# EAGLE design ledgroup (EAGLE 5.11)
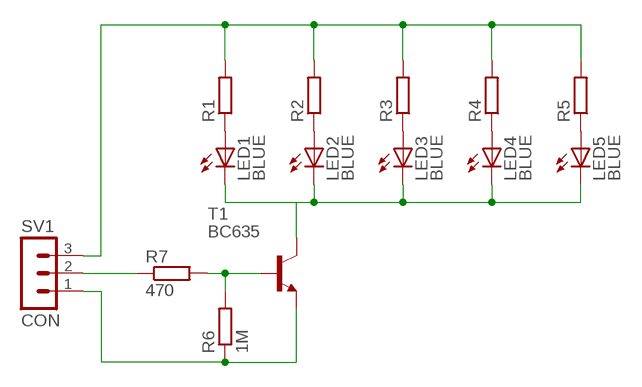
[diagram p0: schematic, sheet 1]

## Parts
LED1  BLUE  LED3MM  [LED3MM]
LED2  BLUE  LED3MM  [LED3MM]
LED3  BLUE  LED3MM  [LED3MM]
LED4  BLUE  LED3MM  [LED3MM]
LED5  BLUE  LED3MM  [LED3MM]
R1  R-EU_0204/7  [0204/7]
R2  R-EU_0204/7  [0204/7]
R3  R-EU_0204/7  [0204/7]
R4  R-EU_0204/7  [0204/7]
R5  R-EU_0204/7  [0204/7]
R6  1M  R-EU_0204/7  [0204/7]
R7  470  R-EU_0204/7  [0204/7]
SV1  CON  MA03-1  [MA03-1]
T1  BC635  BC635-NPN-TO92-ECB  [TO92-ECB]

## Nets
GND: R6.1 SV1.1 T1.E
N$2: R7.1 SV1.2
N$3: R6.2 R7.2 T1.B
N$4: LED3.A R3.1
N$5: LED2.A R2.1
N$6: LED1.A R1.1
N$7: LED4.A R4.1
N$8: LED5.A R5.1
N$9: LED1.K(C) LED2.K(C) LED3.K(C) LED4.K(C) LED5.K(C) T1.C
VCC: R1.2 R2.2 R3.2 R4.2 R5.2 SV1.3

## Library data of the parts
LED1-LED5 = led:LED: LED OSRAM: - CHIPLED LG R971, LG N971, LY N971, LG Q971, LY Q971, LO R971, LY R971 LH N974, LH R974 LS Q976, LO Q976, LY Q976 LO Q996 - Hyper CHIPLED LW Q18S LB Q993, LB Q99A, LB R99A - SideLED LS A670, LO A670, LY A670, LG A670, LP A670 LB A673, LV A673, LT A673, LW A673 LH A674 LY A675 LS A676, LA A676, LO A676, LY A676, LW A676 LS A679, LY A679, LG A679 - Hyper Micro SIDELED® LS Y876, LA Y876, LO Y876, LY Y876 LT Y87S - SmartLED LW L88C, LW L88S LB L89C, LB L89S, LG L890 LS L89K, LO L89K, LY L89K LS L896, LA L896, LO L896, LY L896 - TOPLED LS T670, LO T670, LY T670, LG T670, LP T670 LSG T670, LSP T670, LSY T670, LOP T670, LYG T670 LG T671, LOG T671, LSG T671 LB T673, LV T673, LT T673, LW T673 LH T674 LS T676, LA T676, LO T676, LY T676, LB T676, LH T676, LSB T676, LW T676 LB T67C, LV T67C, LT T67C, LS T67K, LO T67K, LY T67K, LW E67C LS E67B, LA E67B, LO E67B, LY E67B, LB E67C, LV E67C, LT E67C LW T67C LS T679, LY T679, LG T679 LS T770, LO T770, LY T770, LG T770, LP T770 LB T773, LV T773, LT T773, LW T773 LH T774 LS E675, LA E675, LY E675, LS T675 LS T776, LA T776, LO T776, LY T776, LB T776 LHGB T686 LT T68C, LB T68C - Hyper Mini TOPLED® LB M676 - Mini TOPLED Santana® LG M470 LS M47K, LO M47K, LY M47K Source: http://www.osram.convergy.de LUXEON: - LUMILED® LXK2-PW12-R00, LXK2-PW12-S00, LXK2-PW14-U00, LXK2-PW14-V00 LXK2-PM12-R00, LXK2-PM12-S00, LXK2-PM14-U00 LXK2-PE12-Q00, LXK2-PE12-R00, LXK2-PE12-S00, LXK2-PE14-T00, LXK2-PE14-U00 LXK2-PB12-K00, LXK2-PB12-L00, LXK2-PB12-M00, LXK2-PB14-N00, LXK2-PB14-P00, LXK2-PB14-Q00 LXK2-PR12-L00, LXK2-PR12-M00, LXK2-PR14-Q00, LXK2-PR14-R00 LXK2-PD12-Q00, LXK2-PD12-R00, LXK2-PD12-S00 LXK2-PH12-R00, LXK2-PH12-S00 LXK2-PL12-P00, LXK2-PL12-Q00, LXK2-PL12-R00 Source: www.luxeon.com KINGBRIGHT: KA-3528ASYC Source: www.kingbright.com
R1-R7 = rcl:R-EU_: RESISTOR, European symbol
SV1 = con-lstb:MA03-1: PIN HEADER; OC_FARNELL: unknown; OC_NEWARK: unknown
T1 = transistor:*-NPN-: NPN Transistror BF959 corrected 2008.03.06

## Board
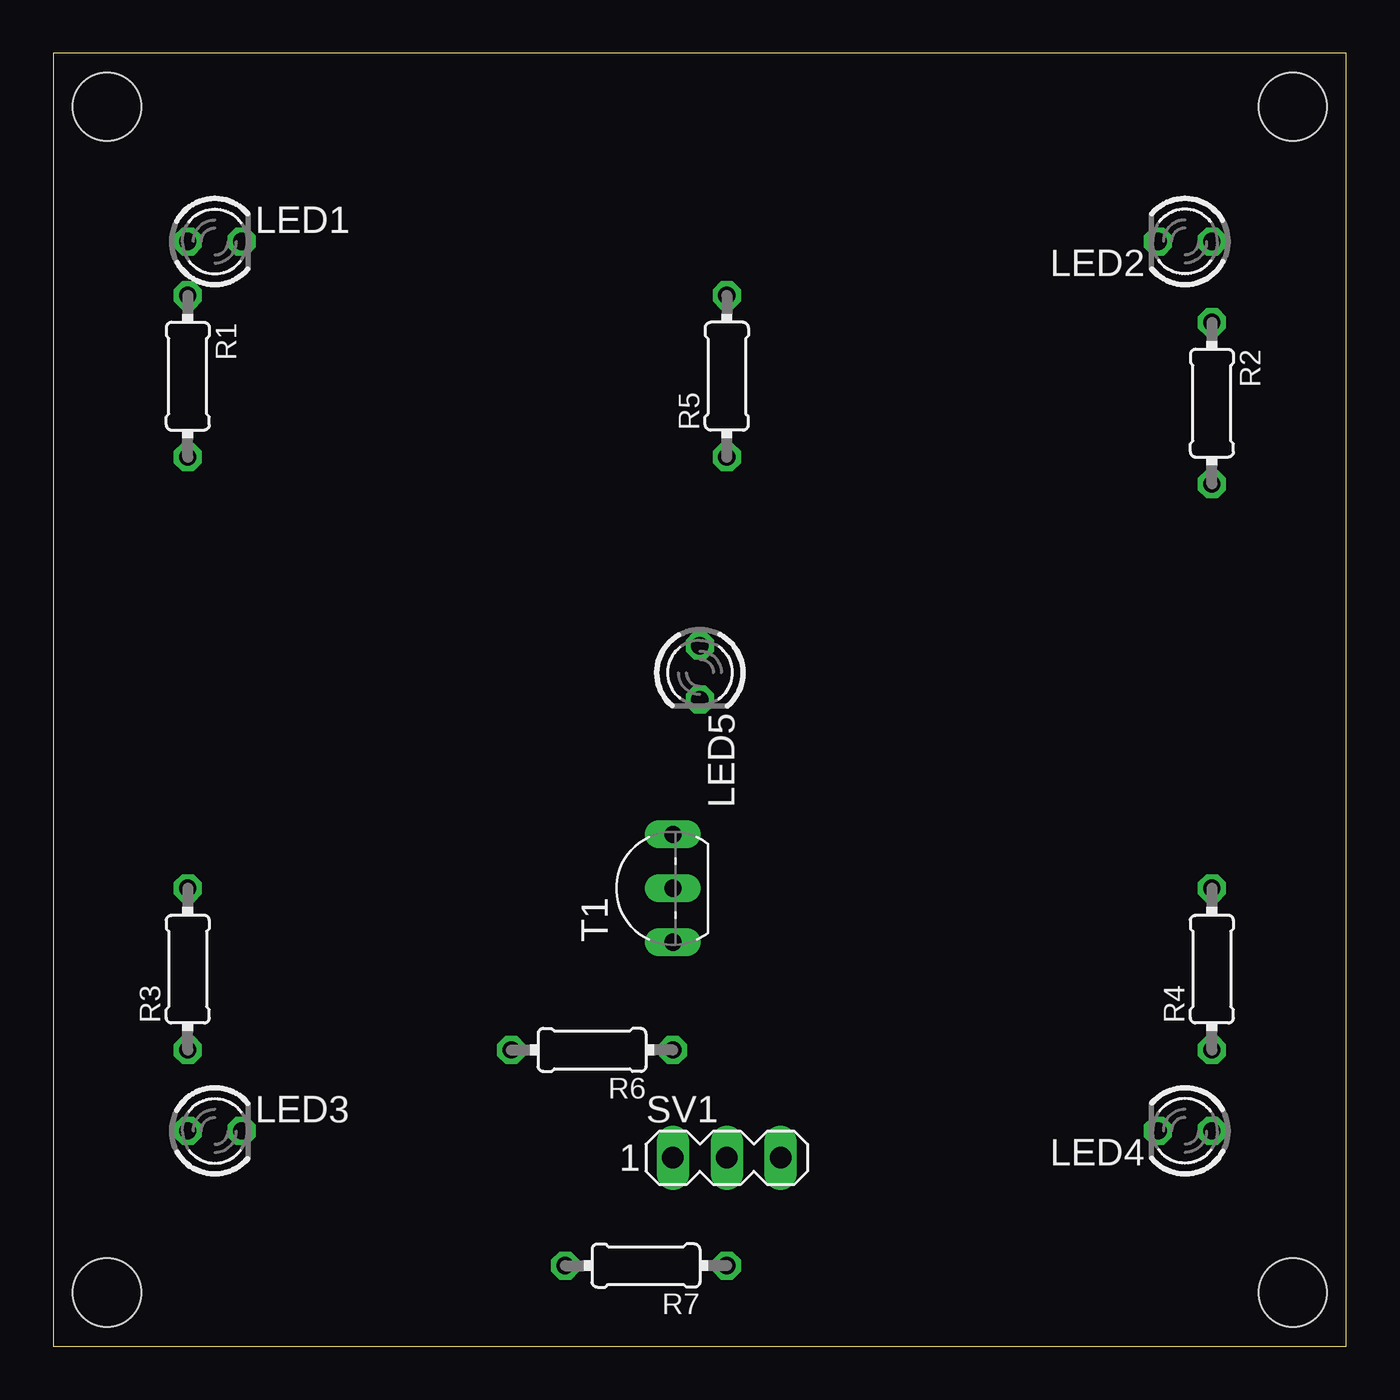
[diagram p1: board, top side]
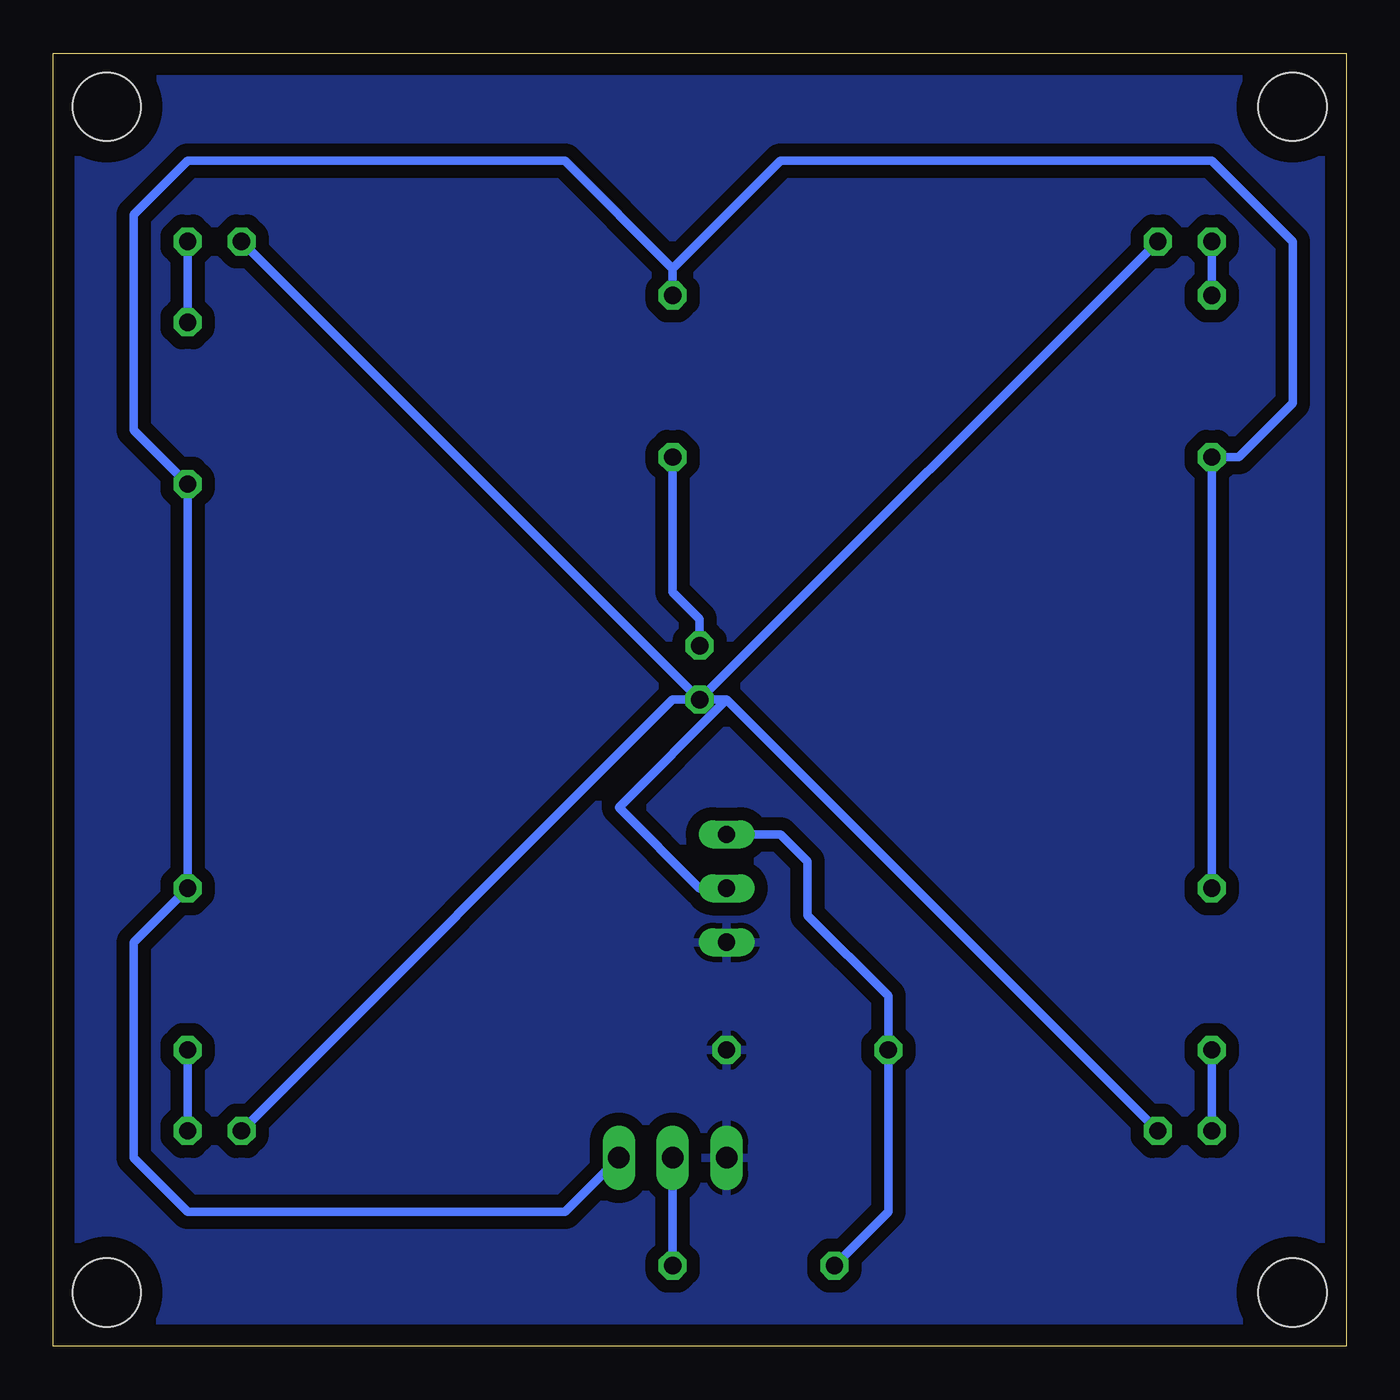
[diagram p2: board, bottom side, seen from below]

Size 60.95 x 60.95 mm. Coordinates in mm from the lower left corner, seen from the top.
Outline: 0,0 60.95,0 60.95,60.95 0,60.95 0,0
Copper layers (1*16): Top 0.035mm / dielectric 1.5mm / Bottom 0.035mm
Design rules "default": minimum track width 10mil, minimum drill 24mil, track to track 8mil, track to pad 8mil, pad to pad 8mil, via to via 8mil, smd to smd 8mil, copper to edge 40mil, drill to drill 8mil, minimum pad ring 10mil, minimum via ring 8mil, stop-mask expansion 4mil, vias tented up to drill 0mil, thermal gap 10mil
Holes 3.2 mm at 2.54,58.42 58.42,58.42 58.42,2.54 2.54,2.54

### Footprints (pad centres in the part's own frame; a part is rotated, then mirrored left to right if it is on the bottom)
LED3MM = drill 0.813 octagon: A -1.27,0; K 1.27,0
0204/7 = drill 0.813 octagon: 1 -3.81,0; 2 3.81,0
MA03-1 = drill 1.016 long: 1 -2.54,0; 2 0,0; 3 2.54,0
TO92-ECB = drill 0.813 long: B 2.54,0; C 0,0; E -2.54,0

### Placement (x,y rotation side)
LED1  7.62,52.07 0 top
LED2  53.34,52.07 180 top
LED3  7.62,10.16 0 top
LED4  53.34,10.16 180 top
LED5  30.48,31.75 270 top
R1  6.35,45.72 270 top
R2  54.61,44.45 270 top
R3  6.35,17.78 90 top
R4  54.61,17.78 90 top
R5  31.75,45.72 90 top
R6  25.4,13.97 180 top
R7  27.94,3.81 180 top
SV1  31.75,8.89 0 top
T1  29.21,21.59 90 top

### Tracks (layer width: path | path; a pad name or v marks a point on that pad's centre or on a via)
GND
  pour Bottom (isolate 0.61): 0,60.96 0,0 60.96,0 60.96,60.96
N$2
  Bottom 0.406: R7.1 SV1.2
N$3
  Bottom 0.406: R7.2 21.59,6.35 R6.2 21.59,16.51 25.4,20.32 25.4,22.86 26.67,24.13 T1.B
N$4
  Bottom 0.406: LED3.A R3.1
N$5
  Bottom 0.406: R2.1 LED2.A
N$6
  Bottom 0.406: R1.1 LED1.A
N$7
  Bottom 0.406: LED4.A R4.1
N$8
  Bottom 0.406: R5.1 31.75,35.56 30.48,34.29 LED5.A
N$9
  Bottom 0.406: LED5.K LED1.K | LED5.K LED2.K | LED3.K 29.21,30.48 | 29.21,30.48 LED5.K | LED4.K 31.75,30.48 LED5.K | 29.21,30.48 34.29,25.4 30.48,21.59 T1.C
VCC
  Bottom 0.406: R3.2 R1.2 5.08,41.91 2.54,44.45 2.54,52.07 6.35,55.88 26.67,55.88 31.75,50.8 | 31.75,50.8 R5.2 | 31.75,50.8 36.83,55.88 54.61,55.88 57.15,53.34 57.15,43.18 R2.2 R4.2 57.15,19.05 57.15,8.89 54.61,6.35 36.83,6.35 SV1.3